# Altium schematic sheet [02] - BLOCK DIAGRAM.SchDoc
size A3; DocumentNumber: 2; SheetNumber: 2; SheetTotal: 8; NameAuthor: Angle Vu
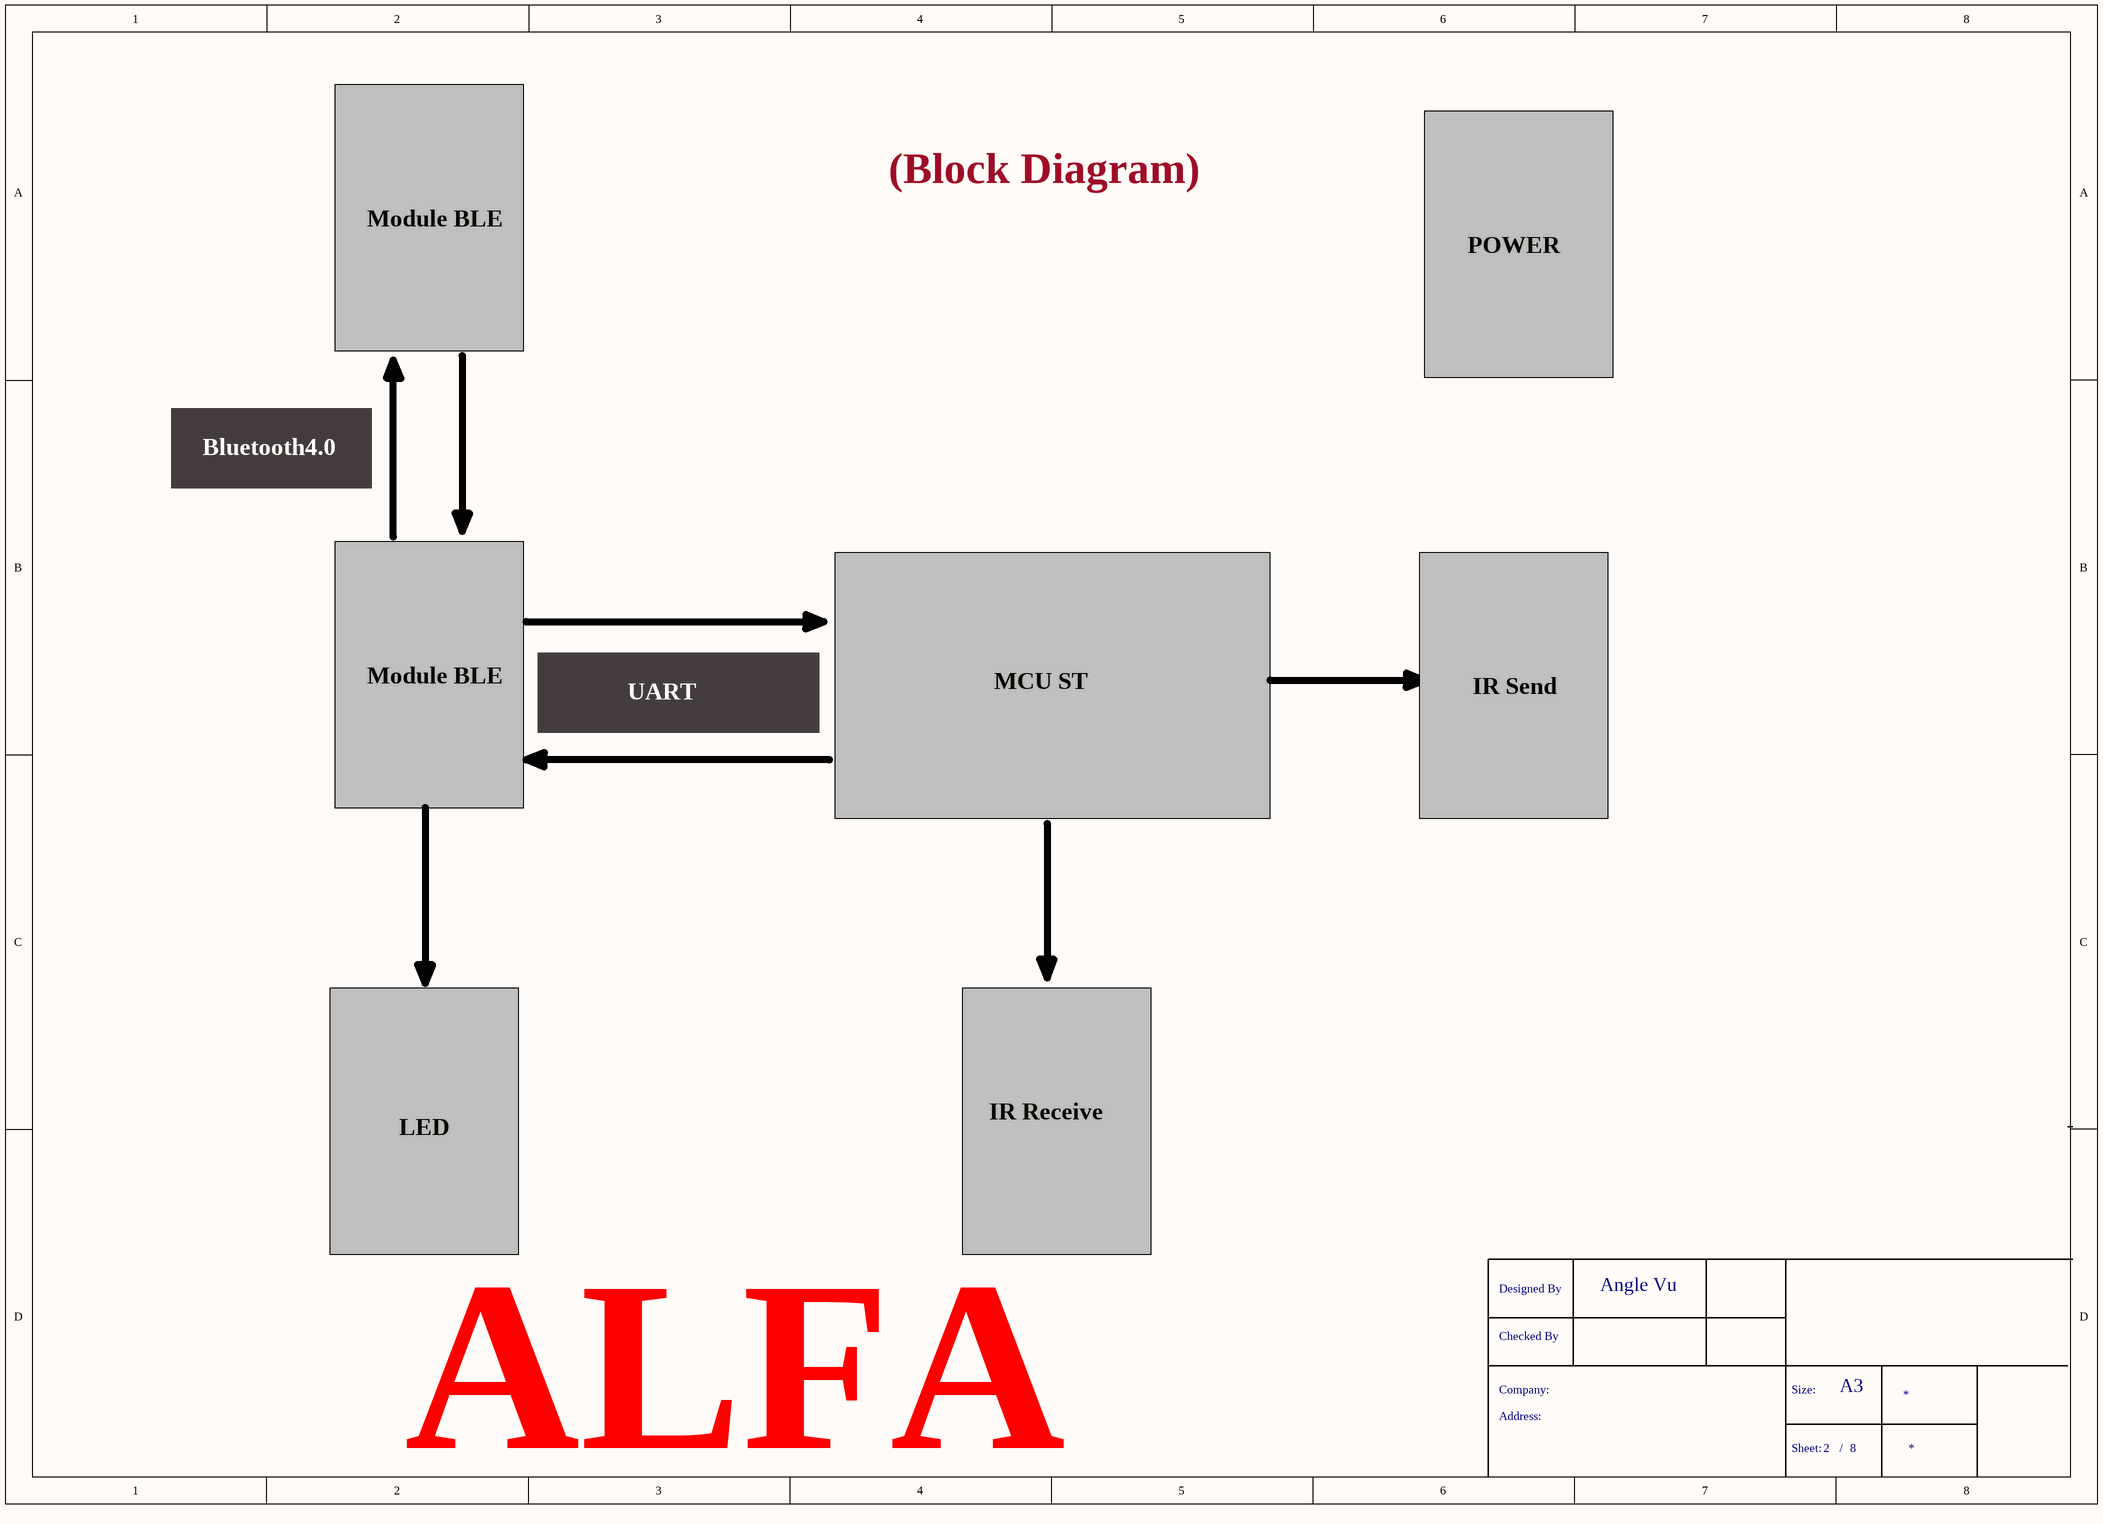
[diagram p0: [02] - BLOCK DIAGRAM.SchDoc]

## Notes on the sheet
- Module BLE
- (Block Diagram)
- POWER
- Bluetooth4.0
- UART
- MCU ST
- IR Send
- IR Receive
- LED
- CLOCKS (CPU & PCIE)
- ALFA
- Designed By
- Checked By
- Company:
- Size:
- A3
- Address:
- Sheet:
- /